# EAGLE design blinkm_battir1 (EAGLE 5.07)
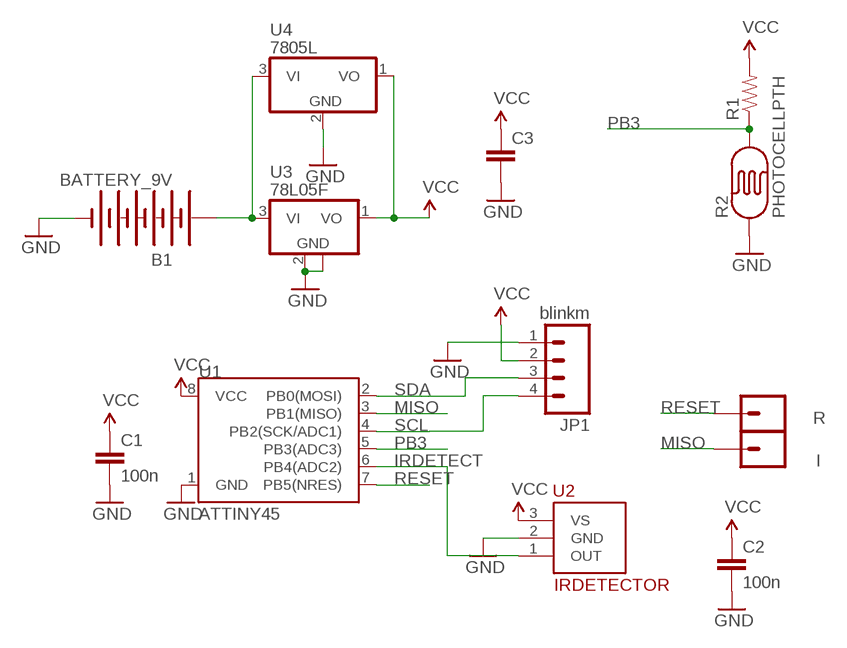
[diagram p0: schematic, sheet 1]

## Parts
B1  BATTERY_9V  [KEYSTONE_968_9V_VERT]
C1  100n  CAP0603-CAP  [0603-CAP]
C2  100n  CAP0603-CAP  [0603-CAP]
C3  CAPPTH  [CAP-PTH-SMALL]
I  M01PTH  [1X01]
JP1  blinkm  M04LOCK  [1X04_LOCK]
R  M01PTH  [1X01]
R1  RESISTOR0603-RES  [0603-RES]
R2  PHOTOCELLPTH  [PHOTOCELL]
U1  ATTINY45  [SO08-EIAJ]
U2  IRDETECTOR  [3PIN-2.54MM]
U3  78L05F  [SOT89]
U4  7805L  [TO92]

## Nets
9V: B1.+ U3.3(VI) U4.3(VI)
GND: B1.- C1.2 C2.2 C3.2 JP1.1 R2.1 U1.1(GND) U2.2(GND) U3.2(GND) U3.2@1(GND) U4.2(GND)
IRDETECT: U1.6(PB4(ADC2)) U2.1(OUT)
MISO: I.1 U1.3(PB1(MISO))
PB3: R1.1 R2.2 U1.5(PB3(ADC3))
RESET: R.1 U1.7(PB5(NRES))
SCL: JP1.4 U1.4(PB2(SCK/ADC1))
SDA: JP1.3 U1.2(PB0(MOSI))
VCC: C1.1 C2.1 C3.1 JP1.2 R1.2 U1.8(VCC) U2.3(VS) U3.1(VO) U4.1(VO)

## Library data of the parts
B1 = todstuff:BATTERY_9V: Keystone Vertical 9V PC snap-on contact http://www.keyelco.com/products/prod29.asp
C1-C3 = SparkFun-20091103:CAP: Capacitor Standard 0603 ceramic capacitor, and 0.1" leaded capacitor.
I R = SparkFun-20091103:M01: Header 1 Standard 1-pin 0.1" header. Use with straight break away headers (SKU : PRT-00116), right angle break away headers (PRT-00553), swiss pins (PRT-00743), machine pins (PRT-00117), and female headers (PRT-00115).
JP1 = SparkFun-20091103:M04: Header 4 Standard 4-pin 0.1" header. Use with straight break away headers (SKU : PRT-00116), right angle break away headers (PRT-00553), swiss pins (PRT-00743), machine pins (PRT-00117), and female headers (PRT-00115). Molex polarized connector foot print use with SKU : PRT-08231 with associated crimp pins and housings.
R1 = SparkFun-20091103:RESISTOR: Resistor Basic schematic elements and footprints for 0603, 1206, and PTH 1/10th watt (small) resistors.
R2 = SparkFun-20091103:PHOTOCELL
U1 = SparkFun-20091103:ATTINY45: Atmel ATTiny45
U2 = todstuff:IRDETECTOR: TSOP348, TSOP322, TSOP382, etc
U3 = linear:78L*: POSITOIV-VOLTAGE REGULATORS Output up to 100 mA Source: http://focus.ti.com/lit/ds/symlink/ua78l05.pdf
U4 = linear:78*: Positive VOLTAGE REGULATOR Source: http://cache.national.com/ds/LM/LM78L05.pdf http://www.fairchildsemi.com/ds/LM/LM7805.pdf

## Board
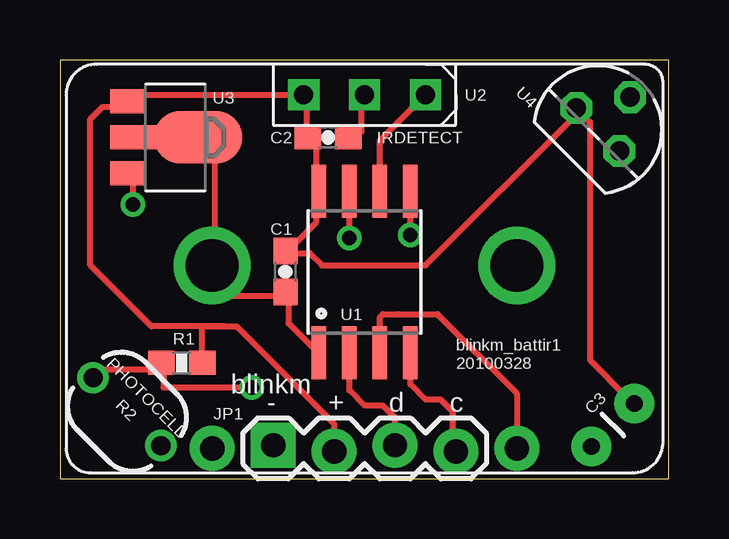
[diagram p1: board, top side]
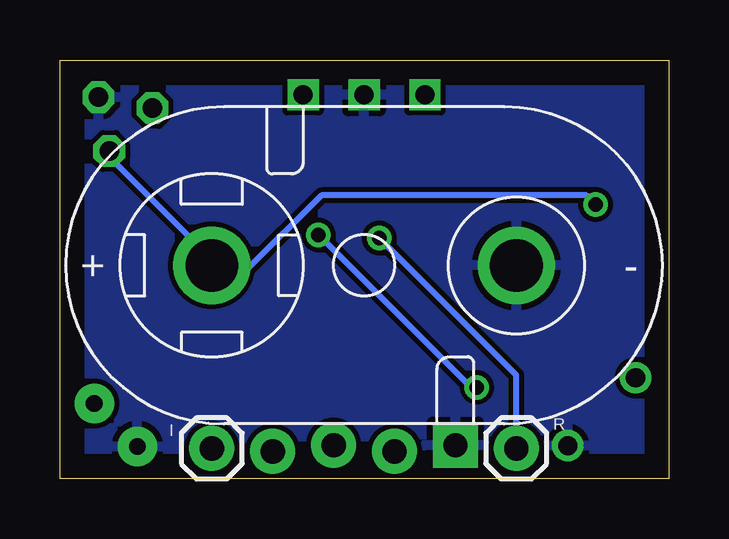
[diagram p2: board, bottom side, seen from below]

Size 25.38 x 17.45 mm. Coordinates in mm from the lower left corner, seen from the top.
Outline: 0,0 25.38,0 25.38,17.45 0,17.45 0,0
Copper layers (1*16): Top 0.035mm / dielectric 1.5mm / Bottom 0.035mm
Design rules "default": minimum track width 10mil, minimum drill 24mil, track to track 8mil, track to pad 8mil, pad to pad 8mil, via to via 8mil, smd to smd 8mil, copper to edge 40mil, drill to drill 8mil, minimum pad ring 10mil, minimum via ring 8mil, stop-mask expansion 4mil, vias tented up to drill 0mil, thermal gap 10mil

### Footprints (pad centres in the part's own frame; a part is rotated, then mirrored left to right if it is on the bottom)
KEYSTONE_968_9V_VERT = drill 2.2 round: + 6.35,0; - -6.35,0
0603-CAP = smd 1.1 x 1: 1 -0.85,0; 2 0.85,0
CAP-PTH-SMALL = drill 0.7 pad 1.651 round: 1 0,0; 2 2.54,0
1X01 = drill 1.016 pad 1.88 round: 1 0,0
1X04_LOCK = drill 1.016 pad 1.88 square: 1 0,0.127 | drill 1.016 pad 1.88 round: 2 2.54,-0.127; 3 5.08,0.127; 4 7.62,-0.127
0603-RES = smd 1.1 x 1: 1 -0.85,0; 2 0.85,0
PHOTOCELL = drill 0.8 round: 1 -2,0; 2 2,0
SO08-EIAJ = smd 0.61 x 2.21: 1 -1.905,-3.378; 2 -0.635,-3.378; 3 0.635,-3.378; 4 1.905,-3.378; 5 1.905,3.353; 6 0.635,3.353; 7 -0.635,3.353; 8 -1.905,3.353
3PIN-2.54MM = drill 0.8 square: 1 -2.54,0; 2 0,0; 3 2.54,0
SOT89 = smd 1 x 1.5: 1 -1.499,-1.981; 3 1.499,-1.981 | smd 1 x 2: 2 0,-1.727 | smd 2.2 x 3.7: 2@1 0,0.94
TO92 = drill 0.813 octagon: 1 -1.27,0; 2 0,1.905; 3 1.27,0

### Placement (x,y rotation side)
B1  12.7,8.89 180 bottom
C1  9.4,8.64 270 top
C2  11.18,14.22 0 top
C3  23.95,3.14 225 top
I  19.05,1.27 0 bottom
JP1  8.89,1.27 0 top
R  6.35,1.27 0 bottom
R1  5.08,4.83 0 top
R2  2.79,2.79 135 top
U1  12.7,8.64 0 top
U2  12.7,16 180 top
U3  4.83,14.22 270 top
U4  22.43,14.55 315 top

### Tracks (layer width: path | path; a pad name or v marks a point on that pad's centre or on a via)
9V  (via drill 0.61)
  Top 0.254: v3.05,11.43 3.05,12.32 3.05,12.57 U3.3
  Bottom 0.254: v3.05,11.43 3.43,11.81 14.48,11.81 17.53,8.76 19.05,8.76 B1.+ 19.05,9.14 23.24,13.34 U4.3
GND
  Top 0.254: 3.43,14.1 U3.2 3.43,14.48 5.71,14.48 U3.2@1 | U3.2@1 5.71,14.1 | C2.2 12.19,14.48 12.57,14.48 12.57,16 U2.2 | U1.1 10.67,5.33 9.53,6.48 9.53,7.62 C1.2 9.14,7.62 6.48,7.62 6.48,8.76 B1.- 6.48,9.14 6.48,14.1 6.1,14.1 U3.2@1
  pour Bottom: 0,17.78 27.94,17.78 27.94,-1.27 0,-1.27
IRDETECT
  Top 0.254: U2.1 13.72,14.48 13.34,14.1 13.34,12.19 U1.6
MISO
  Top 0.254: 19.05,1.52 I.1 19.05,3.56 15.75,6.86 14.1,6.86 13.46,6.86 13.34,6.73 U1.3
PB3  (via drill 0.61)
  Top 0.254: R2.2 1.52,4.57 4.19,4.57 R1.1 4.32,4.57 4.32,3.81 v8,3.81 | v14.61,10.16 14.61,11.68 14.48,11.81 U1.5
  Bottom 0.254: v8,3.81 8.26,3.81 v14.61,10.16
RESET  (via drill 0.61)
  Top 0.254: v12.06,10.03 12.06,12.06 U1.7
  Bottom 0.254: R.1 6.35,3.56 6.35,3.81 6.35,4.32 v12.06,10.03
SCL
  Top 0.254: JP1.4 16.38,1.14 16.38,2.79 15.88,3.3 15.24,3.3 14.61,3.94 U1.4
SDA
  Top 0.254: U1.2 12.06,3.68 12.7,3.05 13.46,3.05 13.97,2.54 JP1.3
VCC
  Top 0.254: C3.1 23.62,3.43 22.1,4.95 22.1,11.05 22.1,14.86 21.72,15.24 U4.1 21.53,15.18 15.24,8.89 10.92,8.89 10.41,9.4 9.49,9.4 C1.1 | 9.53,9.53 10.67,10.67 10.67,11.81 U1.8 10.67,12.19 10.67,14.1 C2.1 10.29,14.48 10.29,16 U2.3 9.91,16 3.05,16 U3.1 2.62,15.49 1.78,15.49 1.27,14.99 1.27,8.89 3.81,6.35 6.86,6.35 | 9.53,9.53 C1.1 | 9.53,9.53 C1.1 | JP1.2 11.43,2.29 10.67,3.05 7.37,6.35 6.86,6.35 | 6.1,4.95 R1.2 5.93,6.35 6.86,6.35

### Text on the board
tPlace: IRDETECT | 20100328 | blinkm_battir1 | blinkm | - | + | d | c | PHOTOCELL